# Altium schematic sheet PlacaPrincipal.SchDoc
size A; SheetNumber: 1; SheetTotal: 4
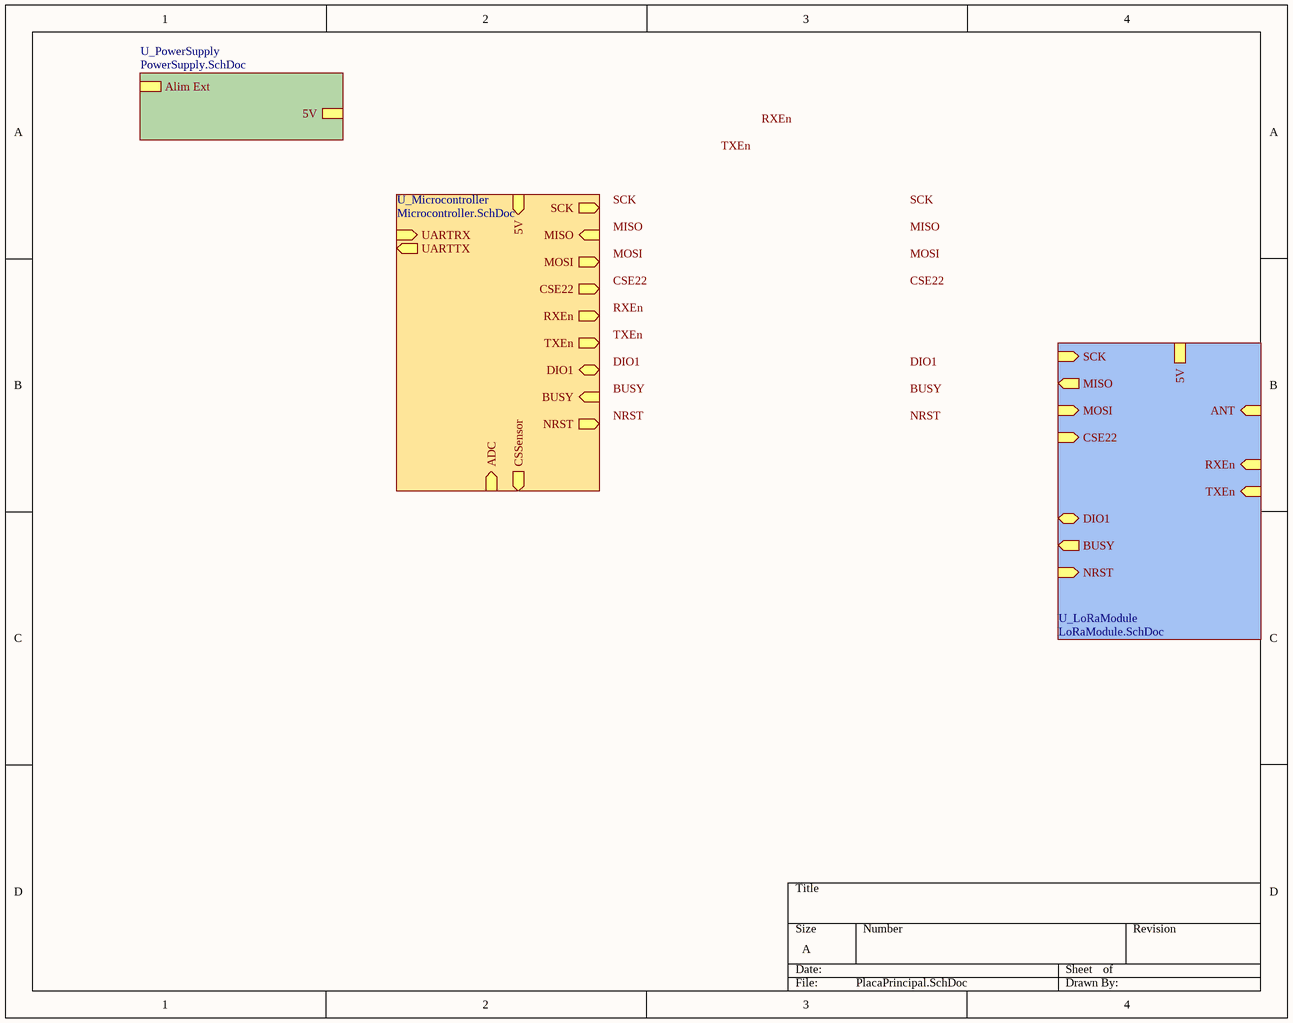
[diagram p0: PlacaPrincipal.SchDoc]

## Sub-sheets
U_LoRaModule = LoRaModule.SchDoc: SCK (in), MOSI (in), MISO (out), CSE22 (in), TXEn (in), BUSY (out), DIO1 (bidir), ANT (in), NRST (in), 5V, RXEn (in)
U_Microcontroller = Microcontroller.SchDoc: MOSI (out), CSE22 (out), UARTRX (in), TXEn (out), BUSY (in), DIO1 (bidir), NRST (out), ADC (in), UARTTX (out), CSSensor (out), MISO (in), 5V (in), SCK (out), RXEn (out)
U_PowerSupply = PowerSupply.SchDoc: Alim Ext, 5V

## Notes on the sheet
- Labels drawn without touching a wire or pin: BUSY, CSE22, DIO1, MISO, MOSI, NRST, RXEn, SCK, TXEn